# EAGLE design PSU v1 (EAGLE 7.2.0)
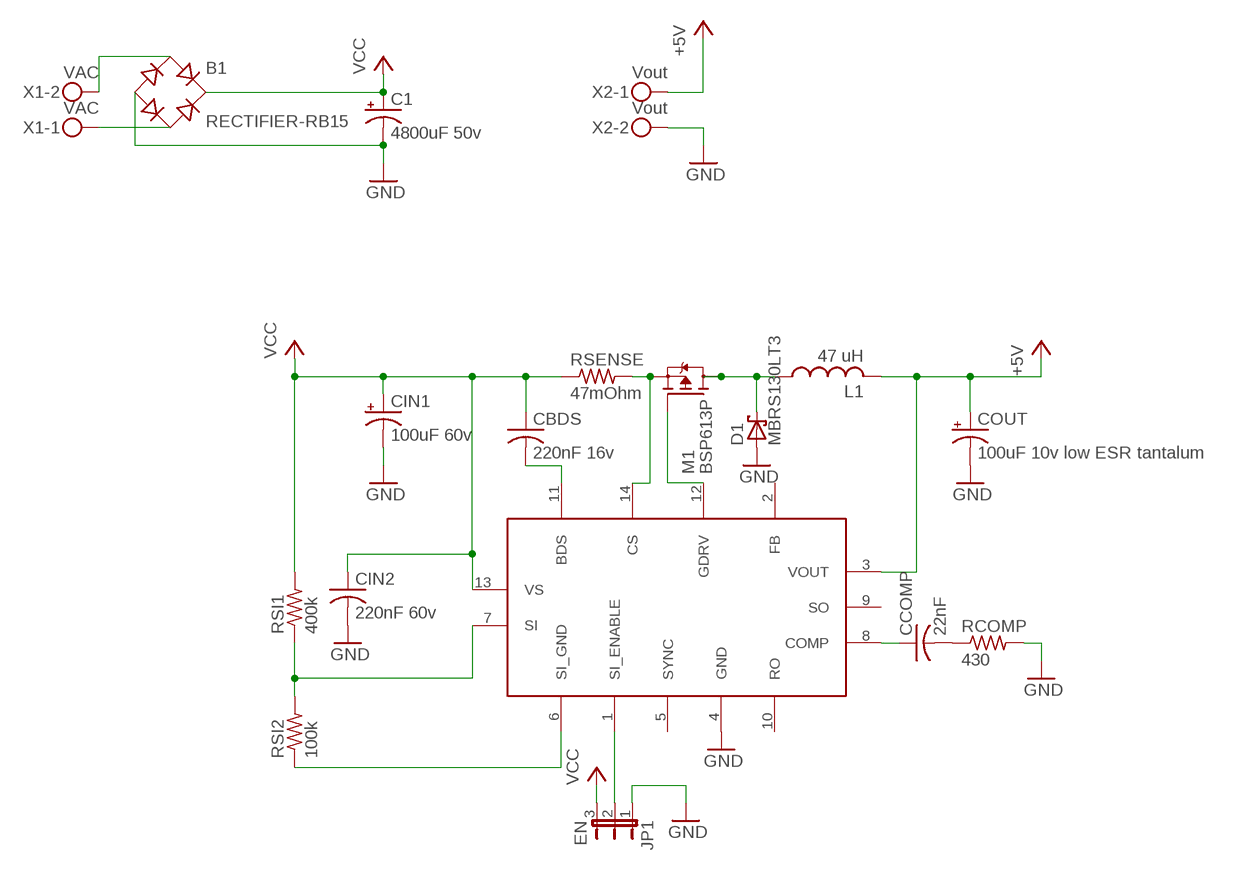
[diagram p0: schematic, sheet 1]

## Parts
B1  RECTIFIER-RB15  [RB15]
C1  4800uF 50v  CPOL-USE7.5-18  [E7,5-18]
CBDS  220nF 16v  C-USC1206  [C1206]
CCOMP  22nF  C-USC1206  [C1206]
CIN1  100uF 60v  CPOL-US140CLH-1010  [140CLH-1010]
CIN2  220nF 60v  C-USC1206  [C1206]
COUT  100uF 10v low ESR tantalum  CPOL-USD/7343-31R  [D/7343-31R]
D1  MBRS130LT3  [SMB]
IC1  IFX80471SKV50  [PG-DSO-14]
JP1  EN  JP2E  [JP2]
L1  47 uH  L-USSRN6045TA  [SRN6045TA]
M1  BSP613P  [PG-SOT-223]
RCOMP  430  R-US_R1206  [R1206]
RSENSE  47mOhm  R-US_R2512  [R2512]
RSI1  400k  R-US_R1206  [R1206]
RSI2  100k  R-US_R1206  [R1206]
X1  VAC  MKDSN1,5/2-5,08  [MKDSN1,5/2-5,08]
X2  Vout  MKDSN1,5/2-5,08  [MKDSN1,5/2-5,08]

## Nets
+5V [power]: COUT.+ IC1.3(VOUT) L1.P$2 X2.1
GND [power]: B1.- C1.- CIN1.- CIN2.2 COUT.- D1.A IC1.4(GND) JP1.1 RCOMP.2 X2.2
N$1 [power]: B1.AC1 X1.2
N$2 [power]: B1.AC2 X1.1
N$3: CBDS.2 IC1.11(BDS)
N$4: IC1.7(SI) RSI1.1 RSI2.2
N$5: IC1.6(SI_GND) RSI2.1
N$6: IC1.14(CS) M1.3(S) RSENSE.2
N$7: CCOMP.2 RCOMP.1
N$8: IC1.12(GDRV) M1.1(G)
N$9: D1.C L1.P$1 M1.2(D) M1.4(D)
N$10: CCOMP.1 IC1.8(COMP)
N$11: IC1.1(SI_ENABLE) JP1.2
VCC [power]: B1.+ C1.+ CBDS.1 CIN1.+ CIN2.1 IC1.13(VS) JP1.3 RSENSE.1 RSI1.2
Unconnected: IC1.2(FB) IC1.5(SYNC) IC1.9(SO) IC1.10(RO)

## Library data of the parts
B1 = rectifier:RECTIFIER-: Rectifier
C1 CIN1 COUT = rcl:CPOL-US: POLARIZED CAPACITOR, American symbol
CBDS CCOMP CIN2 = rcl:C-US: CAPACITOR, American symbol
D1 = diode:MBRS130LT3: Schottky Power Rectifier Source: http://www.onsemi.com/pub/Collateral/MBRS130LT3-D.PDF
IC1 = infineon:IFX80471SKV50
JP1 = jumper:JP2E: JUMPER
L1 = rcl:L-US: INDUCTOR, American symbol
M1 = infineon:BSP613P: SIPMOS (R) Small-Signal-Transistor P-Channel (2 Drain) Source: http://www.infineon.com/dgdl/BSP613P_Rev2.4.pdf; OC_FARNELL: unknown; OC_NEWARK: unknown
RCOMP RSENSE RSI1 RSI2 = rcl:R-US_: RESISTOR, American symbol
X1 X2 = con-phoenix-508:MKDSN1,5/2-5,08: MKDSN 1,5/ 2-5,08 Printklemme Nennstrom: 13,5 A Nennspannung: 250 V Rastermaß: 5,08 mm Polzahl: 2 Anschlussart: Schraubanschluss Montage: Löten Anschlussrichtung Leiter/Platine: 0 ° Artikelnummer: 1729128 Source: http://eshop.phoenixcontact.com .. 1729128.pdf

## Net classes
0 default: width 0.406 mm
1 power: width 1.27 mm

## Board
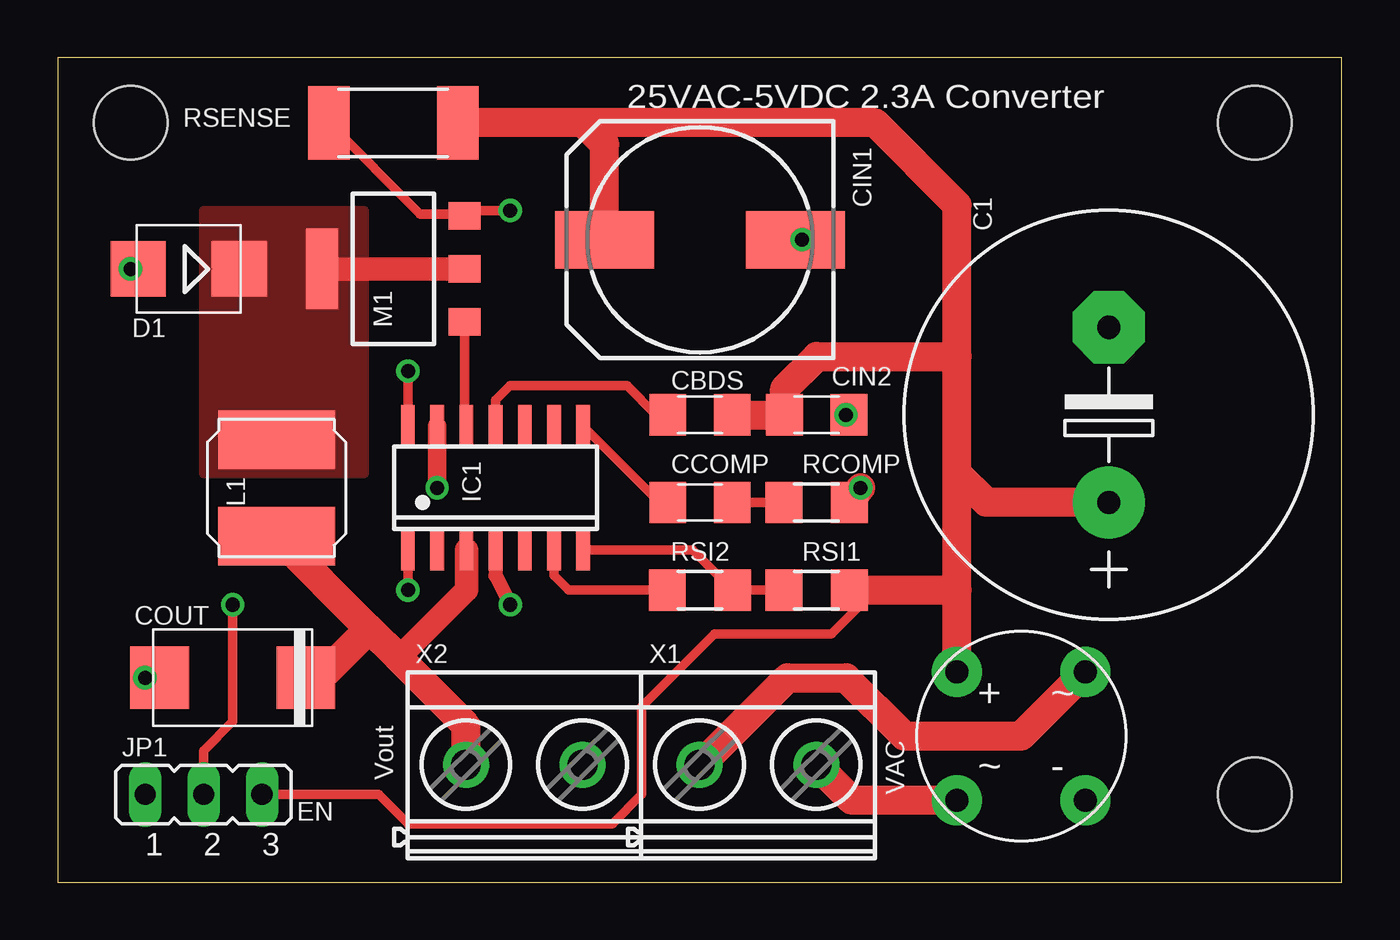
[diagram p1: board, top side]
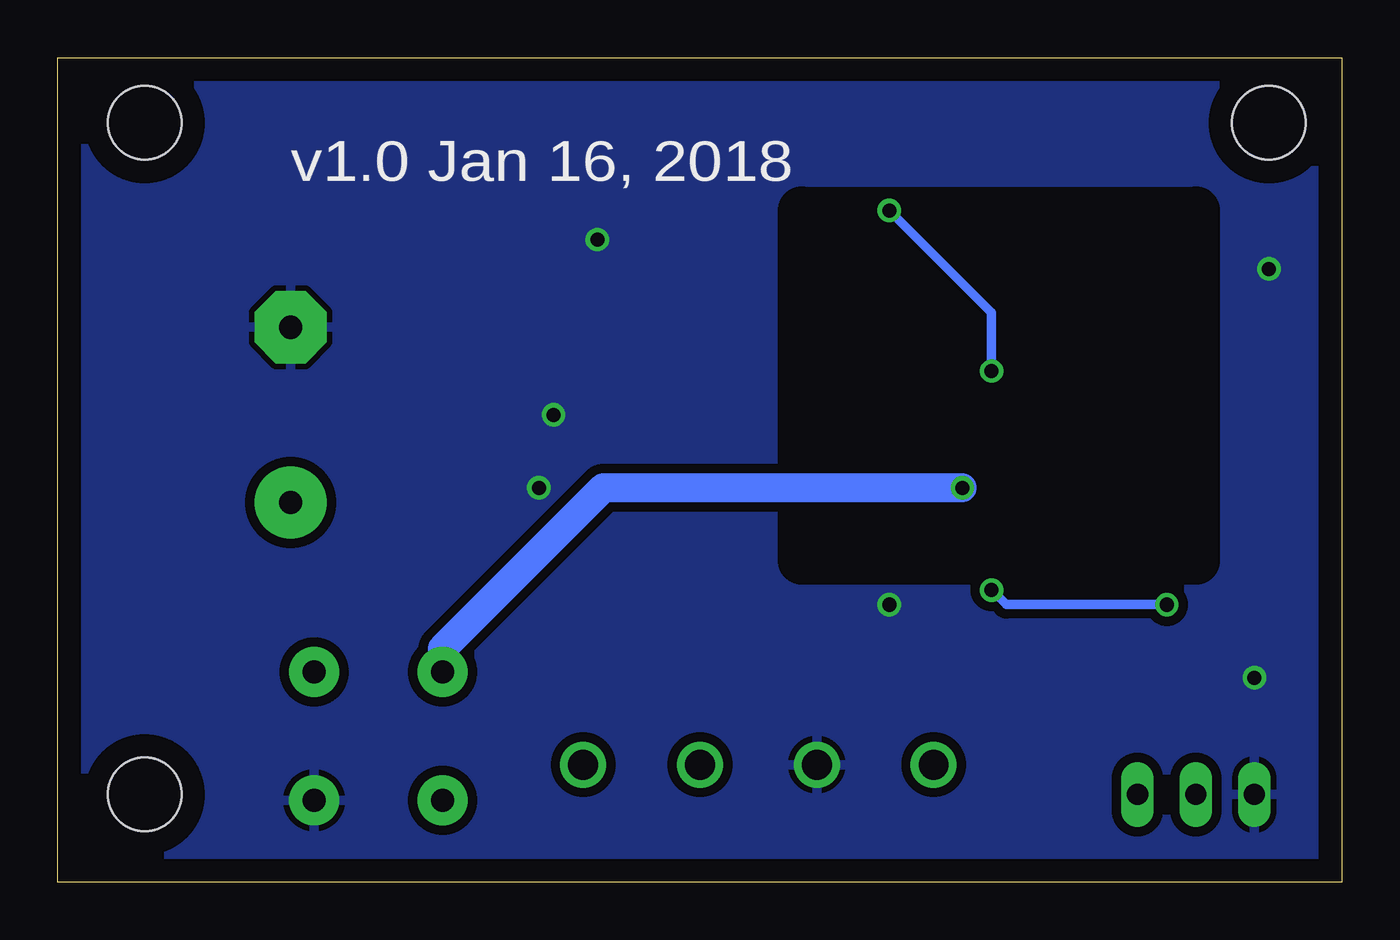
[diagram p2: board, bottom side, seen from below]

Size 55.86 x 35.87 mm. Coordinates in mm from the lower left corner, seen from the top.
Outline: 0,0 55.86,0 55.86,35.87 0,35.87 0,0
Copper layers (1*16): Top 0.035mm / dielectric 1.5mm / Bottom 0.035mm
Design rules "default": minimum track width 10mil, minimum drill 24mil, track to track 8mil, track to pad 8mil, pad to pad 8mil, via to via 8mil, smd to smd 8mil, copper to edge 40mil, drill to drill 8mil, minimum pad ring 10mil, minimum via ring 8mil, stop-mask expansion 4mil, vias tented up to drill 0mil, thermal gap 10mil
Holes 3.2 mm at 3.17,33.02 52.07,3.81 52.07,33.02
bRestrict: area 6.3,14 to 23.5,29.2

### Footprints (pad centres in the part's own frame; a part is rotated, then mirrored left to right if it is on the bottom)
RB15 = drill 1 pad 2.184: + -2.794,2.794; - 2.794,-2.794; AC1 -2.794,-2.794; AC2 2.794,2.794
E7,5-18 = drill 1.016 pad 3.15: + -3.81,0 | drill 1.016 pad 3.15 octagon: - 3.81,0
C1206 = smd 1.6 x 1.8: 1 -1.4,0; 2 1.4,0
140CLH-1010 = smd 4.3 x 2.5: + 4.15,0; - -4.15,0
D/7343-31R = smd 2.55 x 2.7: + 3.175,0; - -3.175,0
SMB = smd 2.4 x 2.4: A 2.2,0; C -2.2,0
PG-DSO-14 = smd 0.6 x 1.8: 1 -5.715,-4.6; 2 -4.445,-4.6; 3 -3.175,-4.6; 4 -1.905,-4.6; 5 -0.635,-4.6; 6 0.635,-4.6; 7 1.905,-4.6; 8 1.905,0.79; 9 0.635,0.79; 10 -0.635,0.79; 11 -1.905,0.79; 12 -3.175,0.79; 13 -4.445,0.79; 14 -5.715,0.79
JP2 = drill 0.914 long: 1 -2.54,0; 2 0,0; 3 2.54,0
SRN6045TA = smd 5.08 x 2.54: P$1 0,-2.1; P$2 0,2.1
PG-SOT-223 = smd 1.2 x 1.4: 1 -2.311,-3.099; 2 0,-3.099; 3 2.311,-3.099 | smd 3.5 x 1.4: 4 0,3.099
R1206 = smd 1.6 x 1.803: 1 -1.422,0; 2 1.422,0
R2512 = smd 1.8 x 3.2: 1 -2.8,0; 2 2.8,0
MKDSN1,5/2-5,08 = drill 1.3 pad 2: 1 -2.561,0.025; 2 2.519,0.025

### Placement (x,y rotation side)
B1  41.91,6.35 0 top
C1  45.72,20.32 90 top
CBDS  27.94,20.32 180 top
CCOMP  27.94,16.51 0 top
CIN1  27.94,27.94 180 top
CIN2  33.02,20.32 0 top
COUT  7.62,8.89 0 top
D1  5.71,26.67 180 top
IC1  20.95,19.05 0 top
JP1  6.35,3.81 0 top
L1  9.53,17.14 180 top
M1  14.61,26.67 90 top
RCOMP  33.02,16.51 0 top
RSENSE  14.61,33.02 180 top
RSI1  33.02,12.7 0 top
RSI2  27.94,12.7 0 top
X1  30.48,5.08 0 top
X2  20.32,5.08 0 top

### Tracks (layer width: path | path; a pad name or v marks a point on that pad's centre or on a via)
+5V
  Top 1.016: IC1.3 17.78,12.7 14.82,9.74
  Top 1.27: X2.1 17.76,6.81 14.82,9.74 13.55,11.02 | 13.55,11.02 L1.P$2 | COUT.+ 11.43,8.89 13.55,11.02
GND  (via drill 0.61)
  Top 0.61: IC1.4 19.05,13.34 v19.68,12.06
  Top 1.27: CIN2.2 v34.29,20.32 | RCOMP.2 v34.92,17.14 | CIN1.- v32.38,27.94 | D1.A v3.17,26.67 | COUT.- v3.81,8.89
  pour Bottom (isolate 0.406): 0,35.56 0,0 55.88,0 55.88,35.56
N$1
  Top 1.27: B1.AC1 34.55,3.56 X1.2
N$2
  Top 1.27: X1.1 27.96,5.11 31.75,8.89 34.29,8.89 36.83,6.35 41.91,6.35 B1.AC2
N$3
  Top 0.406: CBDS.2 26.04,20.32 24.77,21.59 19.68,21.59 19.05,20.95 IC1.11
N$4
  Top 0.406: RSI1.1 RSI2.2 27.61,14.45 IC1.7
N$5
  Top 0.406: RSI2.1 22.23,12.7 21.59,13.34 IC1.6
N$6  (via drill 0.61)
  Top 0.406: IC1.14 v15.24,22.23 | v19.68,29.21 17.93,29.21 M1.3 17.63,29.06 15.77,29.06 RSENSE.2
  Bottom 0.406: v15.24,22.23 15.24,24.77 v19.68,29.21
N$7
  Top 0.406: CCOMP.2 RCOMP.1
N$8
  Top 0.406: M1.1 17.7,19.92 IC1.12
N$9
  Top 1.016: M1.2 M1.4
  pour Top (isolate 0.406, no thermals): 6.35,17.78 13.34,17.78 13.34,29.21 6.35,29.21
N$10
  Top 0.406: CCOMP.1 26.19,16.51 IC1.8
N$11  (via drill 0.61)
  Top 0.406: JP1.2 6.35,5.71 7.62,6.99 v7.62,12.06 | v15.24,12.7 IC1.1
  Bottom 0.406: v7.62,12.06 14.61,12.06 v15.24,12.7
VCC  (via drill 0.61)
  Top 0.406: JP1.3 13.97,3.81 15.24,2.54 24.13,2.54 25.4,3.81 25.4,7.62 28.57,10.79 33.66,10.79 35.56,12.7
  Top 0.813: IC1.13 v16.51,17.14
  Top 1.27: B1.+ 39.12,12.7 | 39.12,12.7 39.12,17.78 | 39.12,17.78 39.12,22.86 | C1.+ 40.39,16.51 39.12,17.78 | CBDS.1 CIN2.1 31.62,21.46 33.02,22.86 39.12,22.86 | RSI1.2 35.56,12.7 39.12,12.7 | 39.12,22.86 39.12,29.46 35.56,33.02 22.86,33.02 | 22.86,33.02 RSENSE.1 | CIN1.+ 23.79,32.09 22.86,33.02
  Bottom 1.27: v16.51,17.14 32.13,17.14 39.12,10.16 B1.+

### Text on the board
tPlace: 25VAC-5VDC 2.3A Converter
bPlace: v1.0 Jan 16, 2018